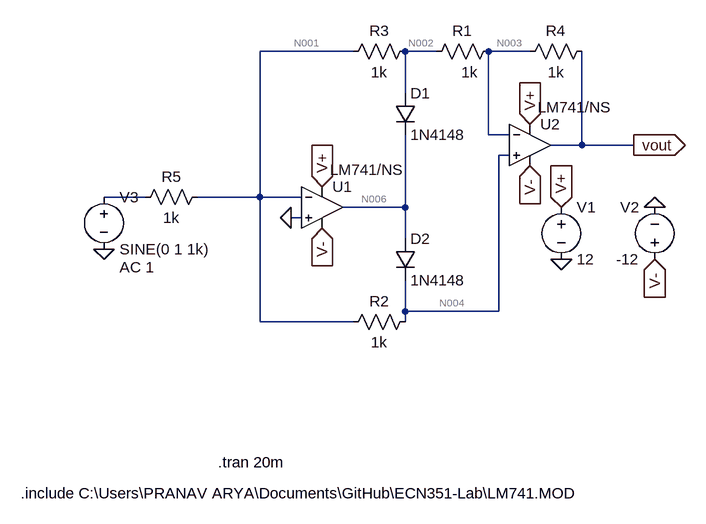
[diagram p0: schematic FullWaweRectifier.asc]
FullWaweRectifier.asc, the LTspice schematic file:
Version 4
SHEET 1 880 680
WIRE 0 -176 -144 -176
WIRE 128 -176 80 -176
WIRE 272 -176 208 -176
WIRE 80 -112 80 -176
WIRE 208 -48 208 -176
WIRE 240 -48 208 -48
WIRE 352 -32 352 -176
WIRE 352 -32 304 -32
WIRE 432 -32 352 -32
WIRE 240 -16 224 -16
WIRE -320 48 -384 48
WIRE -144 48 -144 -176
WIRE -144 48 -240 48
WIRE -80 48 -144 48
WIRE 80 64 80 -48
WIRE 80 64 -16 64
WIRE -80 80 -96 80
WIRE 80 112 80 64
WIRE 80 224 80 176
WIRE 224 224 224 -16
WIRE 224 224 80 224
WIRE -144 240 -144 48
WIRE 0 240 -144 240
WIRE 80 240 80 224
FLAG 320 144 0
FLAG 464 64 0
FLAG -384 128 0
FLAG -96 80 0
FLAG 432 -32 vout
IOPIN 432 -32 Out
FLAG 320 64 V+
IOPIN 320 64 In
FLAG 464 144 V-
IOPIN 464 144 In
FLAG 272 -64 V+
IOPIN 272 -64 In
FLAG -48 32 V+
IOPIN -48 32 In
FLAG 272 0 V-
IOPIN 272 0 In
FLAG -48 96 V-
IOPIN -48 96 In
SYMBOL OpAmps\\opamp2 -48 0 R0
WINDOW 3 12 6 Left 2
SYMATTR Value LM741/NS
SYMATTR InstName U1
SYMBOL voltage 320 48 R0
WINDOW 123 0 0 Left 0
WINDOW 39 0 0 Left 0
SYMATTR InstName V1
SYMATTR Value 12
SYMBOL voltage 464 160 R180
WINDOW 0 24 96 Left 2
WINDOW 3 24 16 Left 2
WINDOW 123 0 0 Left 0
WINDOW 39 0 0 Left 0
SYMATTR InstName V2
SYMATTR Value -12
SYMBOL voltage -384 32 R0
WINDOW 123 24 124 Left 2
WINDOW 39 0 0 Left 0
SYMATTR Value2 AC 1
SYMATTR InstName V3
SYMATTR Value SINE(0 1 1k)
SYMBOL diode 64 -112 R0
SYMATTR InstName D1
SYMATTR Value 1N4148
SYMBOL res 224 -192 R90
WINDOW 0 0 56 VBottom 2
WINDOW 3 32 45 VTop 2
SYMATTR InstName R1
SYMATTR Value 1k
SYMBOL OpAmps\\opamp2 272 -96 R0
WINDOW 3 12 6 Left 2
SYMATTR Value LM741/NS
SYMATTR InstName U2
SYMBOL diode 64 112 R0
SYMATTR InstName D2
SYMATTR Value 1N4148
SYMBOL res 96 224 R90
WINDOW 0 0 56 VBottom 2
WINDOW 3 32 56 VTop 2
SYMATTR InstName R2
SYMATTR Value 1k
SYMBOL res 96 -192 R90
WINDOW 0 0 56 VBottom 2
WINDOW 3 32 56 VTop 2
SYMATTR InstName R3
SYMATTR Value 1k
SYMBOL res 368 -192 R90
WINDOW 0 0 56 VBottom 2
WINDOW 3 32 56 VTop 2
SYMATTR InstName R4
SYMATTR Value 1k
SYMBOL res -224 32 R90
WINDOW 0 0 56 VBottom 2
WINDOW 3 32 56 VTop 2
SYMATTR InstName R5
SYMATTR Value 1k
TEXT -512 504 Left 2 !.include C:\\Users\\PRANAV ARYA\\Documents\\GitHub\\ECN351-Lab\\LM741.MOD
TEXT -208 456 Left 2 !.tran 20m

The netlist it stands for:
* FullWaweRectifier.asc
XU1 0 N001 V+ V- N006 LM741/NS  ; pins In+ In- V+ V- OUT
V1 V+ 0 12
V2 V- 0 -12
V3 N005 0 SINE(0 1 1k) AC 1
D1 N002 N006 1N4148
R1 N003 N002 1k
XU2 N004 N003 V+ V- vout LM741/NS  ; pins In+ In- V+ V- OUT
D2 N006 N004 1N4148
R2 N004 N001 1k
R3 N002 N001 1k
R4 vout N003 1k
R5 N001 N005 1k
.model D D
.lib standard.dio
.include C:\Users\PRANAV ARYA\Documents\GitHub\ECN351-Lab\LM741.MOD
.tran 20m
.backanno
.end

* Results of the author's LTspice run, read from the files saved beside the schematic
* Operating Point, zero values left out:
*   V(n001) = 998.8 µV
*   V(v-) = -12 V
*   V(v+) = 12 V
*   V(n006) = 237.4 mV
*   V(n002) = 1.7 mV
*   V(n003) = 2.398 mV
*   V(n004) = 1.398 mV
*   V(vout) = 3.199 mV
*   I(D2) = 457.5 nA
*   I(D1) = -2.506 nA
*   I(R5) = 998.8 nA
*   I(R4) = 800.4 nA
*   I(R3) = 701.1 nA
*   I(R2) = 399.6 nA
*   I(R1) = 698.6 nA
*   I(V3) = 998.8 nA
*   I(V2) = 3.252 mA
*   I(V1) = -3.253 mA
*   Ix(u1:1) = 57.87 nA
*   Ix(u1:2) = 101.9 nA
*   Ix(u1:99) = 1.626 mA
*   Ix(u1:50) = -1.626 mA
*   Ix(u1:28) = -460 nA
*   Ix(u2:1) = 57.86 nA
*   Ix(u2:2) = 101.9 nA
*   Ix(u2:99) = 1.626 mA
*   Ix(u2:50) = -1.626 mA
*   Ix(u2:28) = -800.4 nA
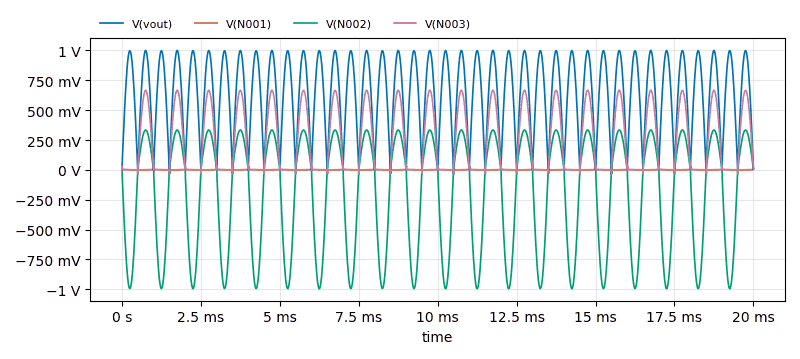
[diagram p1: Transient Analysis of FullWaweRectifier.asc, plotted from the saved traces]
* Transient Analysis, 1 run:
*   V(vout): min -29.49 mV, max 1 V, average 636 mV, rms 706.7 mV, last 14.4 mV
*   V(N001): min -33.44 mV, max 34.15 mV, average 999.7 µV, rms 2.953 mV, last 6.282 mV
*   V(N002): min -995.3 mV, max 334.1 mV, average -209.3 mV, rms 524.1 mV, last 8.88 mV
*   V(N003): min -30.64 mV, max 667.2 mV, average 213.3 mV, rms 333.6 mV, last 11.59 mV